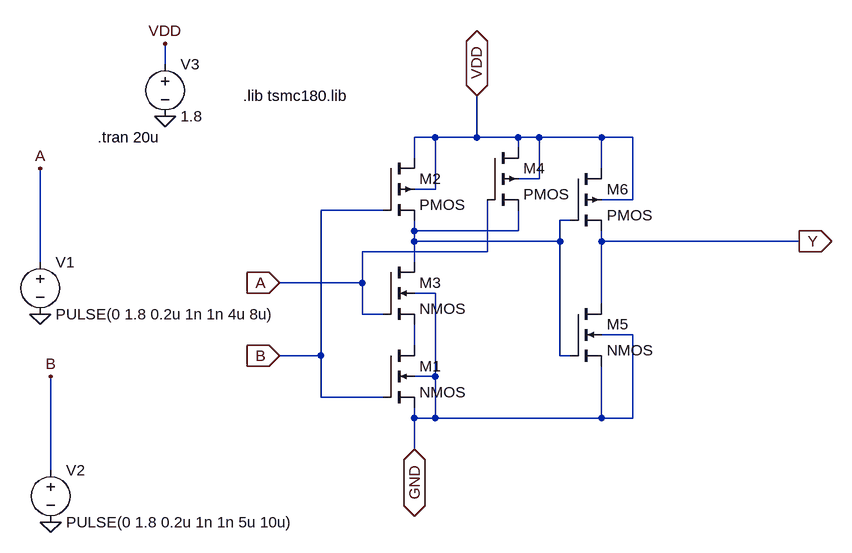
[diagram p0: schematic and_test.asc]
and_test.asc, the LTspice schematic file:
Version 4
SHEET 1 880 680
WIRE -368 -240 -368 -272
WIRE 48 -128 16 -128
WIRE 112 -128 112 -192
WIRE 112 -128 48 -128
WIRE 176 -128 112 -128
WIRE 208 -128 176 -128
WIRE 304 -128 208 -128
WIRE 352 -128 304 -128
WIRE 176 -112 176 -128
WIRE 16 -96 16 -128
WIRE 304 -80 304 -128
WIRE 208 -64 208 -128
WIRE 208 -64 176 -64
WIRE 48 -48 48 -128
WIRE 48 -48 16 -48
WIRE 352 -32 352 -128
WIRE 352 -32 304 -32
WIRE -32 -16 -128 -16
WIRE 256 0 240 0
WIRE 16 16 16 0
WIRE 176 16 176 -16
WIRE 176 16 16 16
WIRE 16 32 16 16
WIRE 240 32 240 0
WIRE 240 32 16 32
WIRE 304 32 304 16
WIRE 608 32 304 32
WIRE 128 48 128 -32
WIRE 128 48 -64 48
WIRE -560 64 -560 -80
WIRE 16 64 16 32
WIRE -64 96 -64 48
WIRE -64 96 -192 96
WIRE 48 112 16 112
WIRE 304 128 304 32
WIRE -64 144 -64 96
WIRE -32 144 -64 144
WIRE 352 176 304 176
WIRE 16 192 16 160
WIRE -128 208 -128 -16
WIRE -128 208 -192 208
WIRE 240 208 240 32
WIRE 256 208 240 208
WIRE 48 240 48 112
WIRE 48 240 16 240
WIRE -128 272 -128 208
WIRE -32 272 -128 272
WIRE 16 304 16 288
WIRE 48 304 48 240
WIRE 48 304 16 304
WIRE 304 304 304 224
WIRE 304 304 48 304
WIRE 352 304 352 176
WIRE 352 304 304 304
WIRE 16 352 16 304
WIRE -544 384 -544 240
FLAG 16 352 GND
IOPIN 16 352 BiDir
FLAG -192 96 A
IOPIN -192 96 In
FLAG -192 208 B
IOPIN -192 208 In
FLAG 608 32 Y
IOPIN 608 32 Out
FLAG 112 -192 VDD
IOPIN 112 -192 BiDir
FLAG -560 144 0
FLAG -560 -80 A
FLAG -544 464 0
FLAG -544 240 B
FLAG -368 -160 0
FLAG -368 -272 VDD
SYMBOL nmos4 -32 192 R0
SYMATTR InstName M1
SYMATTR Value2 l=180n w=2u
SYMBOL pmos4 -32 -96 R0
SYMATTR InstName M2
SYMATTR Value2 l=180n w=300n
SYMBOL nmos4 -32 64 R0
SYMATTR InstName M3
SYMATTR Value2 l=180n w=2u
SYMBOL pmos4 128 -112 R0
SYMATTR InstName M4
SYMATTR Value2 l=180n w=300n
SYMBOL nmos4 256 128 R0
SYMATTR InstName M5
SYMATTR Value2 l=180n w=150n
SYMBOL pmos4 256 -80 R0
SYMATTR InstName M6
SYMATTR Value2 l=180n w=300n
SYMBOL voltage -560 48 R0
WINDOW 123 0 0 Left 0
WINDOW 39 0 0 Left 0
SYMATTR InstName V1
SYMATTR Value PULSE(0 1.8 0.2u 1n 1n 4u 8u)
SYMBOL voltage -544 368 R0
WINDOW 123 0 0 Left 0
WINDOW 39 0 0 Left 0
SYMATTR InstName V2
SYMATTR Value PULSE(0 1.8 0.2u 1n 1n 5u 10u)
SYMBOL voltage -368 -256 R0
WINDOW 123 0 0 Left 0
WINDOW 39 0 0 Left 0
SYMATTR InstName V3
SYMATTR Value 1.8
TEXT -472 -128 Left 2 !.tran 20u
TEXT -248 -192 Left 2 !.lib tsmc180.lib

The netlist it stands for:
* and_test.asc
M1 N002 B GND GND NMOS l=180n w=2u
M2 VDD B N001 VDD PMOS l=180n w=300n
M3 N001 A N002 GND NMOS l=180n w=2u
M4 VDD A N001 VDD PMOS l=180n w=300n
M5 Y N001 GND GND NMOS l=180n w=150n
M6 VDD N001 Y VDD PMOS l=180n w=300n
V1 A 0 PULSE(0 1.8 0.2u 1n 1n 4u 8u)
V2 B 0 PULSE(0 1.8 0.2u 1n 1n 5u 10u)
V3 VDD 0 1.8
.model NMOS NMOS
.model PMOS PMOS
.lib standard.mos
.tran 20u
.lib tsmc180.lib
.backanno
.end